# Altium schematic sheet circuit.SchDoc: MagLev
size A4; DrawnBy: Andres Tosca